# EAGLE design MineralFire-0.3-smd-inprogress (EAGLE 9.1.3)

## Sheet 1 of 3: Main function
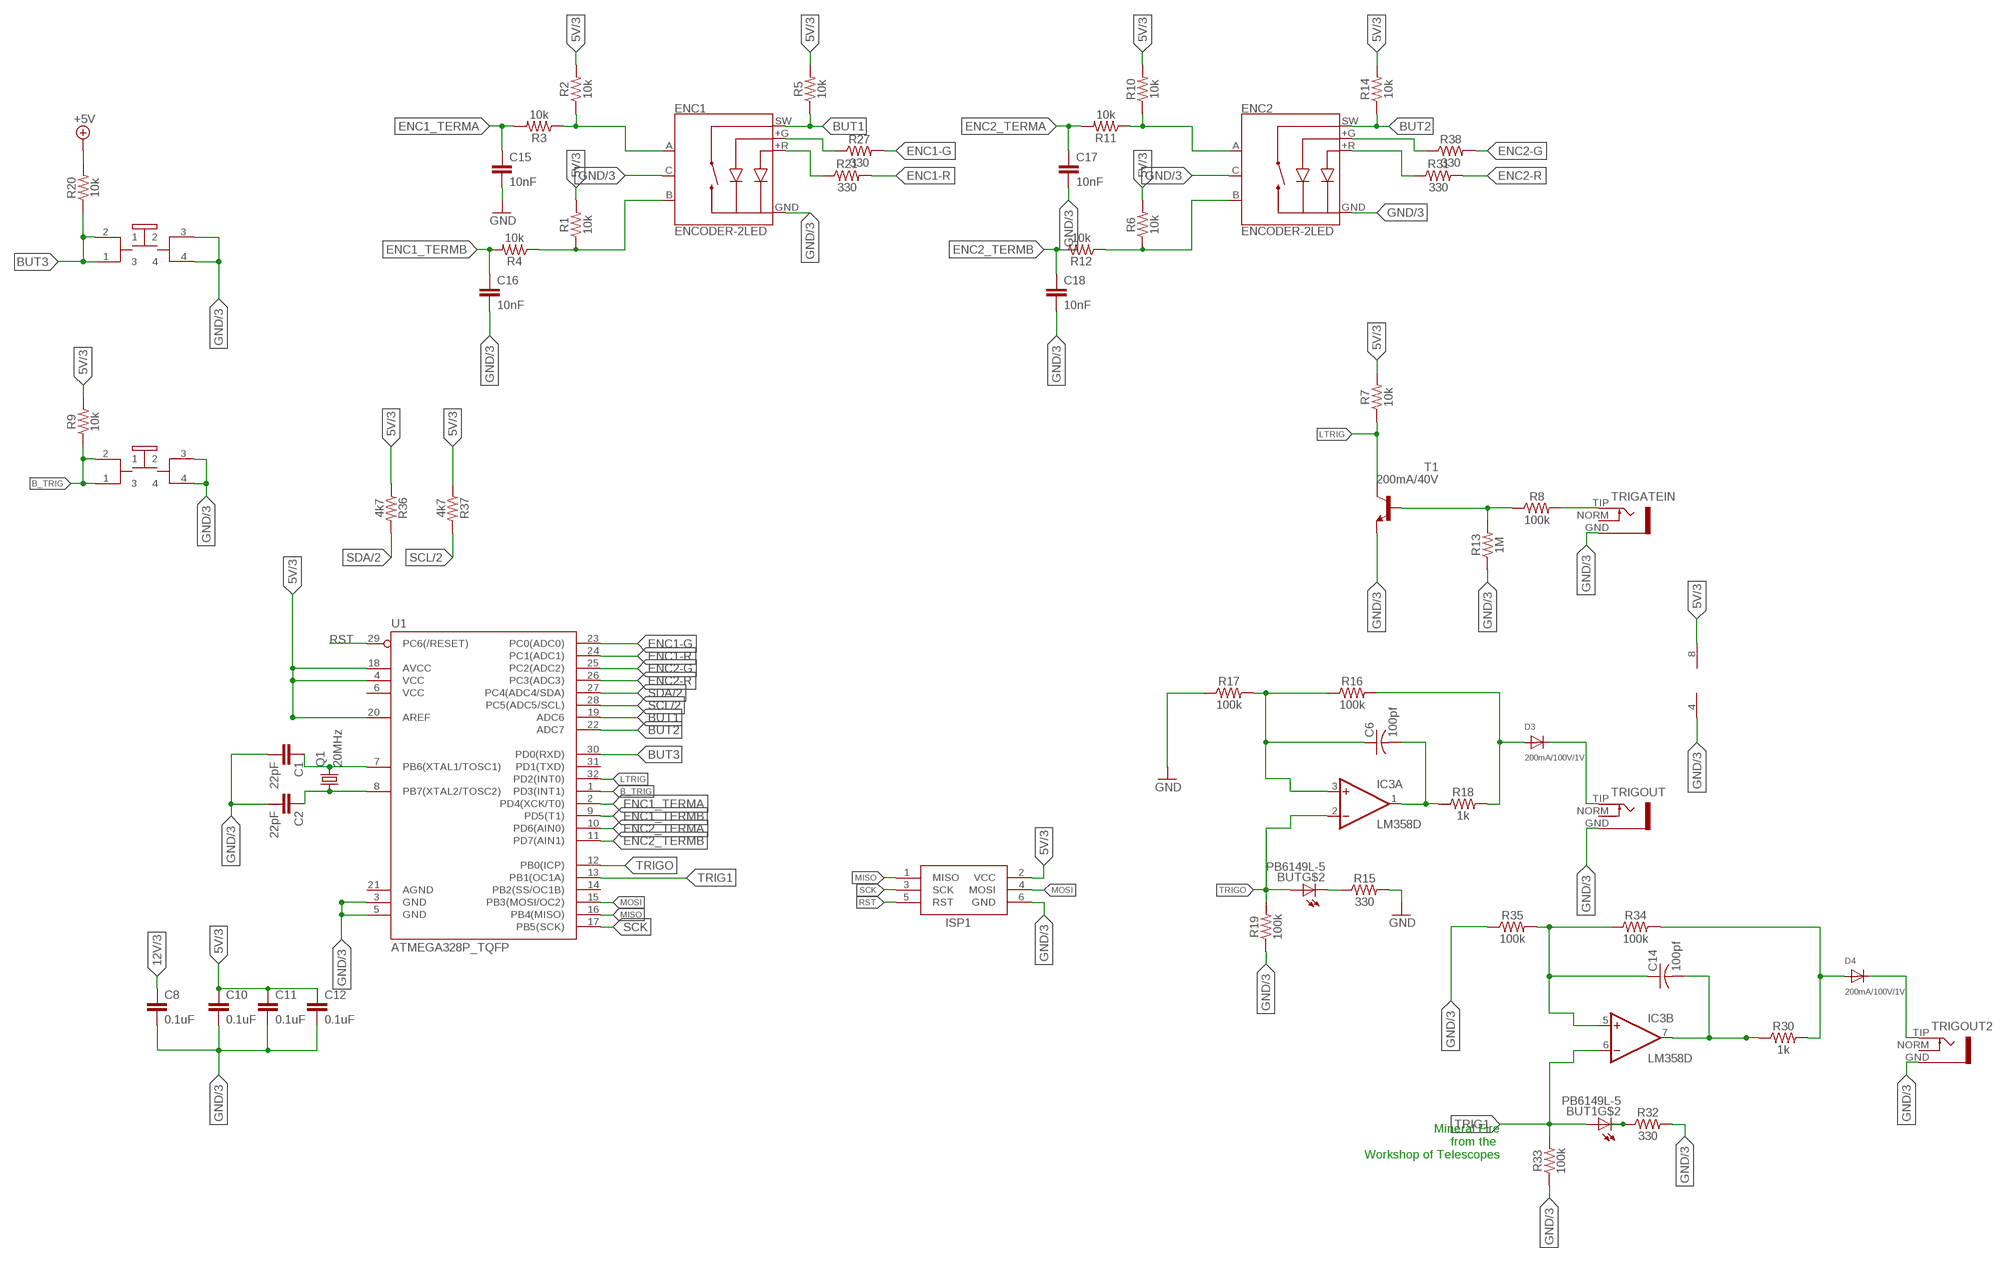
[diagram p0: schematic, sheet 1]

### Parts
BUT  PB6149L-5  [PB6149L]
BUT1  PB6149L-5  [PB6149L]
C1  22pF  22PF-0603-50V-5%  [0603]
C2  22pF  22PF-0603-50V-5%  [0603]
C6  100pf  C-USC0805K  [C0805K]
C8  0.1uF  0.1UF-0603-100V-10%  [0603]
C10  0.1uF  0.1UF-0603-100V-10%  [0603]
C11  0.1uF  0.1UF-0603-100V-10%  [0603]
C12  0.1uF  0.1UF-0603-100V-10%  [0603]
C14  100pf  C-USC0805K  [C0805K]
C15  10nF  10NF-0603-50V-10%  [0603]
C16  10nF  10NF-0603-50V-10%  [0603]
C17  10nF  10NF-0603-50V-10%  [0603]
C18  10nF  10NF-0603-50V-10%  [0603]
D3  200mA/100V/1V  DIODESMA  [SMADIODE]
D4  200mA/100V/1V  DIODESMA  [SMADIODE]
ENC1  ENCODER-2LED  [ENCODER_LED_2]
ENC2  ENCODER-2LED  [ENCODER_LED_2]
IC3  LM358D  [SO08]
ISP1  AVRISP-6  [AVRISP]
Q1  20MHz  CRYSTALHC49UP  [HC49UP]
R1  10k  10KOHM-0603-1/10W-1%  [0603]
R2  10k  10KOHM-0603-1/10W-1%  [0603]
R3  10k  10KOHM-0603-1/10W-1%  [0603]
R4  10k  10KOHM-0603-1/10W-1%  [0603]
R5  10k  10KOHM-0603-1/10W-1%  [0603]
R6  10k  10KOHM-0603-1/10W-1%  [0603]
R7  10k  10KOHM-0603-1/10W-1%  [0603]
R8  100k  100KOHM-0603-1/10W-1%  [0603]
R9  10k  10KOHM-0603-1/10W-1%  [0603]
R10  10k  10KOHM-0603-1/10W-1%  [0603]
R11  10k  10KOHM-0603-1/10W-1%  [0603]
R12  10k  10KOHM-0603-1/10W-1%  [0603]
R13  1M  1MOHM-0603-1/4W-5%  [0603]
R14  10k  10KOHM-0603-1/10W-1%  [0603]
R15  330  330OHM-0603-1/10W-1%  [0603]
R16  100k  100KOHM-0603-1/10W-1%  [0603]
R17  100k  100KOHM-0603-1/10W-1%  [0603]
R18  1k  1KOHM-0603-1/10W-1%  [0603]
R19  100k  100KOHM-0603-1/10W-1%  [0603]
R20  10k  10KOHM-0603-1/10W-1%  [0603]
R21  330  330OHM-0603-1/10W-1%  [0603]
R27  330  330OHM-0603-1/10W-1%  [0603]
R30  1k  1KOHM-0603-1/10W-1%  [0603]
R31  330  330OHM-0603-1/10W-1%  [0603]
R32  330  330OHM-0603-1/10W-1%  [0603]
R33  100k  100KOHM-0603-1/10W-1%  [0603]
R34  100k  100KOHM-0603-1/10W-1%  [0603]
R35  100k  100KOHM-0603-1/10W-1%  [0603]
R36  4k7  1KOHM-0603-1/10W-1%  [0603]
R37  4k7  1KOHM-0603-1/10W-1%  [0603]
R38  330  330OHM-0603-1/10W-1%  [0603]
T1  200mA/40V  MMBT3904LT1-NPN-SOT23-BEC  [SOT23-BEC]
TRIGATEIN  S_JACK  [S_JACK]
TRIGOUT  S_JACK  [S_JACK]
TRIGOUT2  S_JACK  [S_JACK]
U1  ATMEGA328P_TQFP  [TQFP32-08]

### Nets
5V: C10.1 C11.1 C12.1 IC3.8(P:V+) ISP1.2(VCC) R1.2 R2.2 R5.2 R6.2 R7.2 R9.2 R10.2 R14.2 R36.1 R37.1 U1.4(VCC) U1.18(AVCC) U1.20(AREF) ; also sheet 3
12V [12V]: C8.1 ; also sheet 3
+5V [Power]: R20.2 ; also sheet 2
B_TRIG: BUT.1 BUT.2 R9.1 U1.1(PD3(INT1))
BUT1 [Power]: ENC1.SW R5.1 U1.19(ADC6)
BUT2 [Power]: ENC2.SW R14.1 U1.22(ADC7)
BUT3: BUT1.1 BUT1.2 R20.1 U1.30(PD0(RXD))
ENC1-G: R27.2 U1.23(PC0(ADC0))
ENC1-R: R21.2 U1.24(PC1(ADC1))
ENC1_TERMA: C15.1 R3.2 U1.2(PD4(XCK/T0))
ENC1_TERMB: C16.1 R4.2 U1.9(PD5(T1))
ENC2-G: R38.2 U1.25(PC2(ADC2))
ENC2-R: R31.2 U1.26(PC3(ADC3))
ENC2_TERMA: C17.1 R11.2 U1.10(PD6(AIN0))
ENC2_TERMB: C18.1 R12.2 U1.11(PD7(AIN1))
GND [Power]: BUT1.3 BUT1.4 BUT.3 BUT.4 C1.2 C2.2 C8.2 C10.2 C11.2 C12.2 C15.2 C16.2 C17.2 C18.2 ENC1.C ENC1.GND(-) ENC2.C ENC2.GND(-) IC3.4(P:V-) ISP1.6(GND) R13.1 R15.2 R17.1 R19.1 R32.2 R33.1 R35.1 T1.E TRIGATEIN.GND TRIGOUT2.GND TRIGOUT.GND U1.3(GND) U1.5(GND) ; also sheet 2,3
LTRIG: R7.1 T1.C U1.32(PD2(INT0))
MISO: ISP1.1(MISO) U1.16(PB4(MISO))
MOSI: ISP1.4(MOSI) U1.15(PB3(MOSI/OC2))
N$1: C1.1 Q1.2 U1.7(PB6(XTAL1/TOSC1))
N$2: C2.1 Q1.1 U1.8(PB7(XTAL2/TOSC2))
N$3: ENC1.+R R21.1
N$6: ENC1.A R2.1 R3.1
N$12: ENC1.B R1.1 R4.1
N$15: R8.1 R13.2 T1.B
N$18: R8.2 TRIGATEIN.TIP
N$19: C14.2 IC3.7(B:OUT) R30.1
N$21: BUT1.K(C) R32.1
N$22: D4.A R30.2 R34.2
N$23: D4.C TRIGOUT2.TIP
N$24: C14.1 IC3.5(B:+IN) R34.1 R35.2
N$27: ENC2.A R10.1 R11.1
N$28: ENC2.B R6.1 R12.1
N$30: ENC1.+G R27.1
N$31: BUT.K(C) R15.1
N$32: C6.1 IC3.3(A:+IN) R16.1 R17.2
N$33: C6.2 IC3.1(A:OUT) R18.1
N$34: D3.A R16.2 R18.2
N$35: ENC2.+G R38.1
N$36: ENC2.+R R31.1
N$74: D3.C TRIGOUT.TIP
RST: ISP1.5(RST) U1.29(PC6(/RESET))
SCK: ISP1.3(SCK) U1.17(PB5(SCK))
SCL: R37.2 U1.28(PC5(ADC5/SCL)) ; also sheet 2
SDA: R36.2 U1.27(PC4(ADC4/SDA)) ; also sheet 2
TRIG1: BUT1.A IC3.6(B:-IN) R33.2 U1.13(PB1(OC1A))
TRIGO: BUT.A IC3.2(A:-IN) R19.2 U1.12(PB0(ICP))
Unconnected: TRIGATEIN.NORM TRIGOUT2.NORM TRIGOUT.NORM U1.6(VCC) U1.14(PB2(SS/OC1B)) U1.21(AGND) U1.31(PD1(TXD))

### Notes on the sheet
- Mineral Fire
  from the 
  Workshop of Telescopes

## Sheet 2 of 3: Display
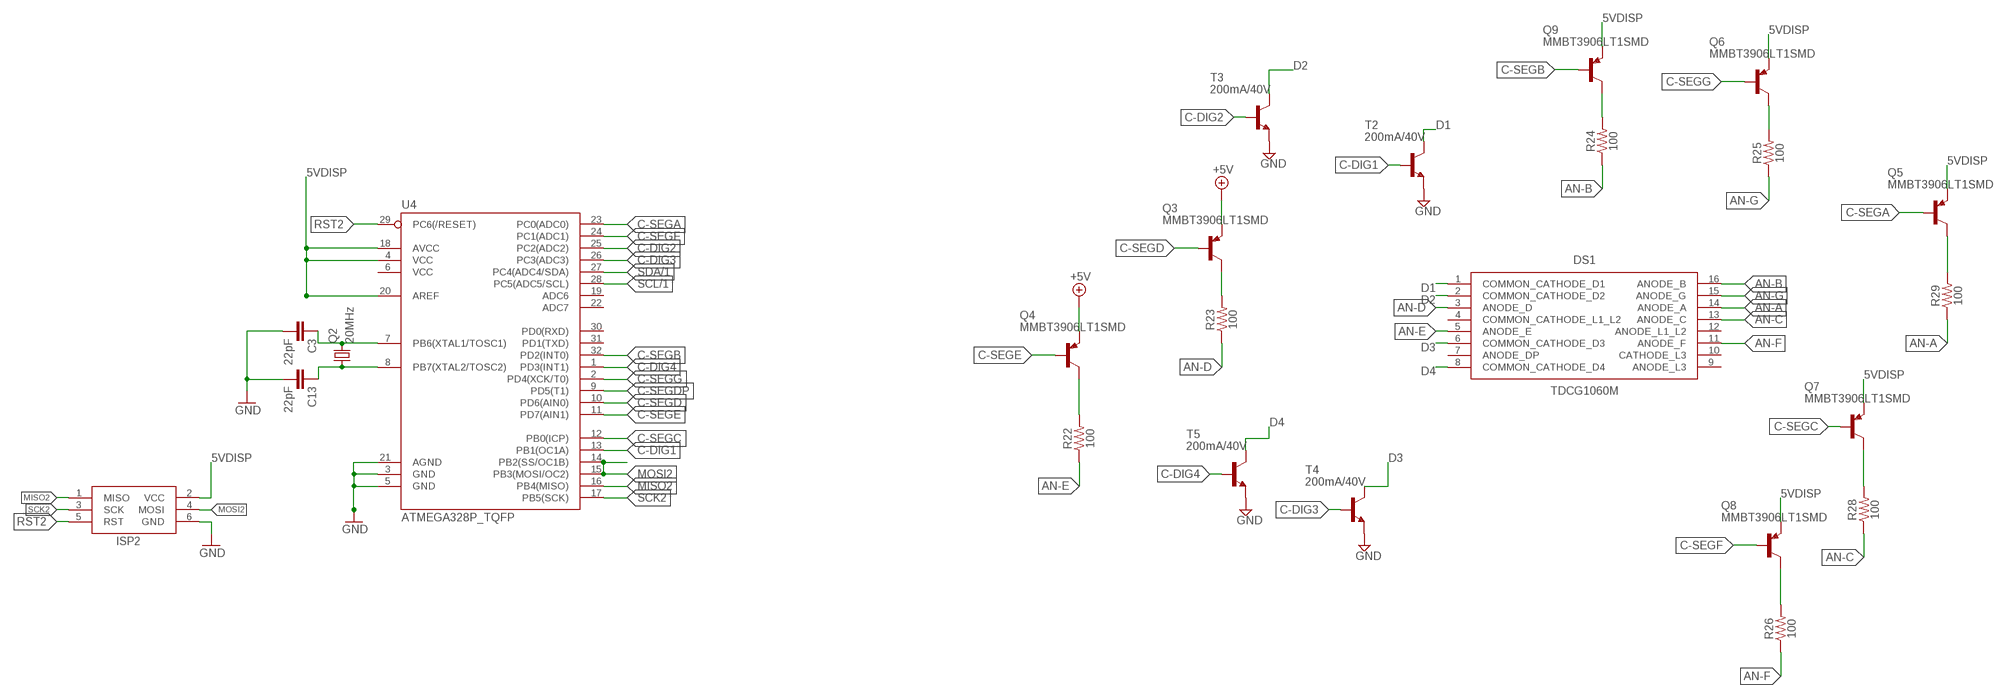
[diagram p1: schematic, sheet 2]

### Parts
C3  22pF  22PF-0603-50V-5%  [0603]
C13  22pF  22PF-0603-50V-5%  [0603]
DS1  TDCG1060M  [DIPS1016W50P254L4020H700Q16N]
ISP2  AVRISP-6  [AVRISP]
Q2  20MHz  CRYSTALHC49UP  [HC49UP]
Q3  MMBT3906LT1SMD  [SOT23-BEC]
Q4  MMBT3906LT1SMD  [SOT23-BEC]
Q5  MMBT3906LT1SMD  [SOT23-BEC]
Q6  MMBT3906LT1SMD  [SOT23-BEC]
Q7  MMBT3906LT1SMD  [SOT23-BEC]
Q8  MMBT3906LT1SMD  [SOT23-BEC]
Q9  MMBT3906LT1SMD  [SOT23-BEC]
R22  100  100OHM-0603-1/10W-1%  [0603]
R23  100  100OHM-0603-1/10W-1%  [0603]
R24  100  100OHM-0603-1/10W-1%  [0603]
R25  100  100OHM-0603-1/10W-1%  [0603]
R26  100  100OHM-0603-1/10W-1%  [0603]
R28  100  100OHM-0603-1/10W-1%  [0603]
R29  100  100OHM-0603-1/10W-1%  [0603]
T2  200mA/40V  MMBT3904LT1-NPN-SOT23-BEC  [SOT23-BEC]
T3  200mA/40V  MMBT3904LT1-NPN-SOT23-BEC  [SOT23-BEC]
T4  200mA/40V  MMBT3904LT1-NPN-SOT23-BEC  [SOT23-BEC]
T5  200mA/40V  MMBT3904LT1-NPN-SOT23-BEC  [SOT23-BEC]
U4  ATMEGA328P_TQFP  [TQFP32-08]

### Nets
5VDISP [Power]: ISP2.2(VCC) Q5.E Q6.E Q7.E Q8.E Q9.E U4.4(VCC) U4.18(AVCC) U4.20(AREF) ; also sheet 3
+5V [Power]: Q3.E Q4.E ; also sheet 1
AN-A: DS1.14(ANODE_A) R29.1
AN-B: DS1.16(ANODE_B) R24.1
AN-C: DS1.13(ANODE_C) R28.1
AN-D: DS1.3(ANODE_D) R23.1
AN-E: DS1.5(ANODE_E) R22.1
AN-F: DS1.11(ANODE_F) R26.1
AN-G: DS1.15(ANODE_G) R25.1
C-DIG1: T2.B U4.13(PB1(OC1A))
C-DIG2: T3.B U4.25(PC2(ADC2))
C-DIG3: T4.B U4.26(PC3(ADC3))
C-DIG4: T5.B U4.1(PD3(INT1))
C-SEGA: Q5.B U4.23(PC0(ADC0))
C-SEGB: Q9.B U4.32(PD2(INT0))
C-SEGC: Q7.B U4.12(PB0(ICP))
C-SEGD: Q3.B U4.10(PD6(AIN0))
C-SEGDP: U4.9(PD5(T1))
C-SEGE: Q4.B U4.11(PD7(AIN1))
C-SEGF: Q8.B U4.24(PC1(ADC1))
C-SEGG: Q6.B U4.2(PD4(XCK/T0))
D1: DS1.1(COMMON_CATHODE_D1) T2.C
D2: DS1.2(COMMON_CATHODE_D2) T3.C
D3: DS1.6(COMMON_CATHODE_D3) T4.C
D4: DS1.8(COMMON_CATHODE_D4) T5.C
GND [Power]: C3.2 C13.2 ISP2.6(GND) T2.E T3.E T4.E T5.E U4.3(GND) U4.5(GND) U4.21(AGND) ; also sheet 1,3
MISO2: ISP2.1(MISO) U4.16(PB4(MISO))
MOSI2: ISP2.4(MOSI) U4.14(PB2(SS/OC1B)) U4.15(PB3(MOSI/OC2))
N$5: Q4.C R22.2
N$7: C3.1 Q2.2 U4.7(PB6(XTAL1/TOSC1))
N$8: C13.1 Q2.1 U4.8(PB7(XTAL2/TOSC2))
N$11: Q3.C R23.2
N$13: Q9.C R24.2
N$14: Q8.C R26.2
N$16: Q7.C R28.2
N$17: Q6.C R25.2
N$20: Q5.C R29.2
RST2: ISP2.5(RST) U4.29(PC6(/RESET))
SCK2: ISP2.3(SCK) U4.17(PB5(SCK))
SCL: U4.28(PC5(ADC5/SCL)) ; also sheet 1
SDA: U4.27(PC4(ADC4/SDA)) ; also sheet 1
Unconnected: DS1.4(COMMON_CATHODE_L1_L2) DS1.7(ANODE_DP) DS1.9(ANODE_L3) DS1.10(CATHODE_L3) DS1.12(ANODE_L1_L2) U4.6(VCC) U4.19(ADC6) U4.22(ADC7) U4.30(PD0(RXD)) U4.31(PD1(TXD))

## Sheet 3 of 3: Power
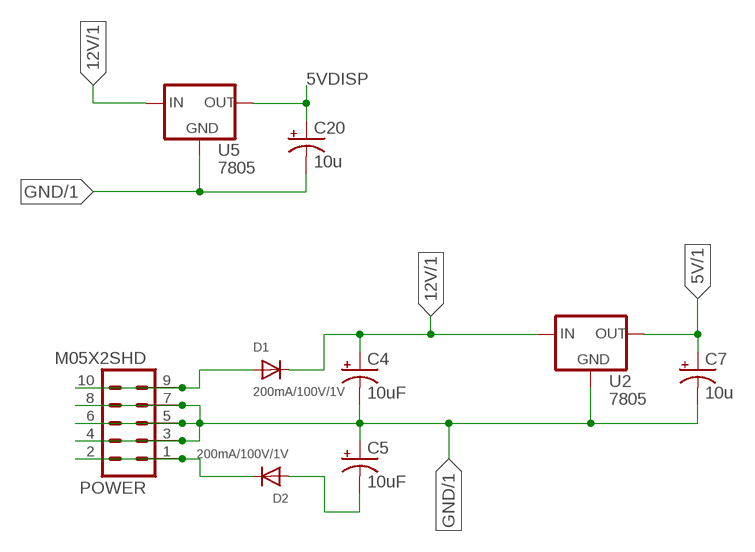
[diagram p2: schematic, sheet 3]

### Parts
C4  10uF  CPOL-US153CLV-0505  [153CLV-0505]
C5  10uF  CPOL-US153CLV-0505  [153CLV-0505]
C7  10u  CPOL-US153CLV-0505  [153CLV-0505]
C20  10u  CPOL-US153CLV-0505  [153CLV-0505]
D1  200mA/100V/1V  DIODESMA  [SMADIODE]
D2  200mA/100V/1V  DIODESMA  [SMADIODE]
POWER  M05X2SHD  [2X5-SHROUDED]
U2  7805  V-REG  [V-REG]
U5  7805  V-REG  [V-REG]

### Nets
5V: C7.+ U2.3(OUT) ; also sheet 1
5VDISP [Power]: C20.+ U5.3(OUT) ; also sheet 2
12V [12V]: C4.+ D1.C U2.1(IN) U5.1(IN) ; also sheet 1
GND [Power]: C4.- C5.+ C7.- C20.- POWER.3 POWER.4 POWER.5 POWER.6 POWER.7 POWER.8 U2.4(GND) U5.4(GND) ; also sheet 1,2
N$9: D1.A POWER.9 POWER.10
N$10: D2.C POWER.1 POWER.2
N$38 [Power]: C5.- D2.A

## Library data of the parts
BUT BUT1 = INSTRUO:PB6149L-5
C1-C3 C13 = SparkFun-Capacitors:22PF: 22pF ceramic capacitors A capacitor is a passive two-terminal electrical component used to store electrical energy temporarily in an electric field.; PROD_ID: CAP-07876
C4 C5 = rcl:CPOL-US: POLARIZED CAPACITOR, American symbol; SPICEPREFIX: C
C6 C14 = rcl:C-US: CAPACITOR, American symbol; SPICEPREFIX: C
C7 C20 = rcl:CPOL-US: POLARIZED CAPACITOR, American symbol
C8 C10-C12 = SparkFun-Capacitors:0.1UF: 0.1µF ceramic capacitors A capacitor is a passive two-terminal electrical component used to store electrical energy temporarily in an electric field.; PROD_ID: CAP-08390
C15-C18 = SparkFun-Capacitors:10NF: 0.01uF/10nF/10,000pF ceramic capacitors A capacitor is a passive two-terminal electrical component used to store electrical energy temporarily in an electric field. CAP-09321; PROD_ID: CAP-00867
D1-D4 = adafruit:DIODE: Diode SMADIODE - SMA Surface Mount Package 20V 1A Schottky Diode Digikey: 641-1014-6-ND DO-1N4148 - Through Hole Small Current Diode SOD-123 20V 1 A (.5mV Vf) Schottky Diode - Digikey: MBRX120TPMSCT-ND SOD-323 10V 570mA (.38mV Vf, 3ns) Schottky Diode - Digikey: ZLLS410CT-ND SOD-523 30V 30mA Schottky Diode (RB751S-40TE61) - Digikey: RB751S-40TE61CT-ND SOT23-R/W - SOT23 Package (R = Solder Paste/Reflow Ovens, W = Hand-Soldering) BAT54Film 40V 300mA - Digikey: 497-7162-1-ND
DS1 = TDCG1060M:TDCG1060M: VISHAY - TDCG1060M - DISPLAY, SEVEN SEGMENT, 10MM, GREEN <https://componentsearchengine.com/Images/1/TDCG1060M.jpg> Source: Datasheet <http://www.mouser.com/ds/2/427/tdc10m-88849.pdf>; DESCRIPTION: VISHAY - TDCG1060M - DISPLAY, SEVEN SEGMENT, 10MM, GREEN; HEIGHT: 7mm; MANUFACTURER_NAME: Vishay; MANUFACTURER_PART_NUMBER: TDCG1060M; RS_PART_NUMBER: 8187530P; SUPPLIER_NAME: RS
ENC1 ENC2 = SparkFun-Switches:ENCODER-2LED: Illuminated Rotary Encoder w/ 2 LEDs Rotary encoders rotate similarly to potentiometers, but they’re different from potentiometers in that an encoder has full rotation without limits. They output gray code so that you can tell how much and in which direction the encoder has been turned. This encoder has a red/green LED built-in, which shines through the encoder shaft. SparkFun Products Rotary Encoder - Illuminated (Red/Green) <https://www.sparkfun.com/products/10596> (COM-10596) SparkFun Rotary Encoder Breakout - Illuminated (RG/RGB) <https://www.sparkfun.com/products/11722> (BOB-11722); PROD_ID: COMP-11113; SF_SKU: COM-10596
IC3 = linear:LM358: OP AMP also LM158; LM258; LM2904 Source: http://cache.national.com/ds/LM/LM158.pdf
ISP1 ISP2 = adafruit:AVRISP: AVR ISP HEADER Standard 6 pin header for AVR programming
POWER = SparkFun-Connectors:M05X2: Header 5x2 Standard 10-pin dual row 0.1" header. Commonly used with AVR-ISP. Use with Spark Fun Electronics SKU: PRT-00778
Q1 Q2 = adafruit:CRYSTAL: CRYSTAL; OC_FARNELL: unknown; OC_NEWARK: unknown
Q3-Q9 = transistor-pnp:MMBT3906*: PNP Transistror
R1-R7 R9-R12 R14 R20 = SparkFun-Resistors:10KOHM: 10kΩ resistor A resistor is a passive two-terminal electrical component that implements electrical resistance as a circuit element. Resistors act to reduce current flow, and, at the same time, act to lower voltage levels within circuits. - Wikipedia; PROD_ID: RES-00824
R8 R16 R17 R19 R33-R35 = SparkFun-Resistors:100KOHM: 100kΩ resistor A resistor is a passive two-terminal electrical component that implements electrical resistance as a circuit element. Resistors act to reduce current flow, and, at the same time, act to lower voltage levels within circuits. - Wikipedia; PROD_ID: RES-07828
R13 = SparkFun-Resistors:1MOHM: 1MΩ resistor A resistor is a passive two-terminal electrical component that implements electrical resistance as a circuit element. Resistors act to reduce current flow, and, at the same time, act to lower voltage levels within circuits. - Wikipedia; PROD_ID: RES-07868
R15 R21 R27 R31 R32 R38 = SparkFun-Resistors:330OHM: 330Ω resistor A resistor is a passive two-terminal electrical component that implements electrical resistance as a circuit element. Resistors act to reduce current flow, and, at the same time, act to lower voltage levels within circuits. - Wikipedia; PROD_ID: RES-00818
R18 R30 = SparkFun-Resistors:1KOHM: 1kΩ resistor A resistor is a passive two-terminal electrical component that implements electrical resistance as a circuit element. Resistors act to reduce current flow, and, at the same time, act to lower voltage levels within circuits. - Wikipedia; PROD_ID: RES-07856
R22-R26 R28 R29 = SparkFun-Resistors:100OHM: 100Ω resistor A resistor is a passive two-terminal electrical component that implements electrical resistance as a circuit element. Resistors act to reduce current flow, and, at the same time, act to lower voltage levels within circuits. - Wikipedia; PROD_ID: RES-07863
R36 R37 = SparkFun-Resistors:1KOHM: 1kΩ resistor A resistor is a passive two-terminal electrical component that implements electrical resistance as a circuit element. Resistors act to reduce current flow, and, at the same time, act to lower voltage levels within circuits. - Wikipedia; PROD_ID: RES-07856; VALUE: 1k
T1-T5 = transistor:*-NPN-: NPN Transistror BF959 corrected 2008.03.06
TRIGATEIN TRIGOUT TRIGOUT2 = INSTRUO:S_JACK
U1 U4 = SparkFun-IC-Microcontroller:ATMEGA328P_TQFP: Popular 328P in QFP Storefront component: ATmega328 - TQFP <https://www.sparkfun.com/products/13448> (COM-13448) Datasheet <http://www.sparkfun.com/datasheets/Components/SMD/ATMega328.pdf> SparkFun Products SparkFun RedBoard - Programmed with Arduino <https://www.sparkfun.com/products/12757> (DEV-12757) Arduino Pro Mini 328 - 5V/16MHz <https://www.sparkfun.com/products/11113> (DEV-11113) Arduino Pro Mini 328 - 3.3V/8MHz <https://www.sparkfun.com/products/11114> (DEV-11114) SparkFun OpenLog <https://www.sparkfun.com/products/13712> (DEV-13712) SparkFun MicroView - OLED Arduino Module <https://www.sparkfun.com/products/12923> (DEV-12923) SparkFun Digital Sandbox <https://www.sparkfun.com/products/12651> (DEV-12651) SparkFun PicoBoard <https://www.sparkfun.com/products/11888> (WIG-11888) Arduino Fio <https://www.sparkfun.com/products/10116> (DEV-10116) LilyPad Arduino 328 Main Board <https://www.sparkfun.com/products/13342> (DEV-13342) SparkFun RedStick <https://www.sparkfun.com/products/13741> (DEV-13741) LilyPad MP3 <https://www.sparkfun.com/products/11013> (DEV-11013) LilyPad Arduino SimpleSnap <https://www.sparkfun.com/products/10941> (DEV-10941) SparkFun Stepoko <https://www.sparkfun.com/products/13899> (ROB-13899) SparkFun Geiger Counter <https://www.sparkfun.com/products/11345> (SEN-11345) SparkFun EL Sequencer <https://www.sparkfun.com/products/12781> (COM-12781) Arduino Pro 328 - 5V/16MHz <https://www.sparkfun.com/products/10915> (DEV-10915) CryptoCape <https://www.sparkfun.com/products/12773> (DEV-12773) SparkFun IR Thermometer Evaluation Board - MLX90614 <https://www.sparkfun.com/products/10740> (SEN-10740) SparkFun RedBot Mainboard <https://www.sparkfun.com/products/12097> (ROB-12097) Arduino Pro 328 - 3.3V/8MHz <https://www.sparkfun.com/products/10914> (DEV-10914) SparkFun Block for Intel® Edison - Arduino <https://www.sparkfun.com/products/13036> (DEV-13036) SparkFun Simon Says - Surface Mount Soldering Kit <https://www.sparkfun.com/products/10935> (KIT-10935) SparkFun 7-Segment Serial Display - Red <https://www.sparkfun.com/products/11441> (COM-11441) SparkFun 7-Segment Serial Display - White <https://www.sparkfun.com/products/11629> (COM-11629) SparkFun 7-Segment Serial Display - Yellow <https://www.sparkfun.com/products/11443> (COM-11443) SparkFun 7-Segment Serial Display - Kelly Green <https://www.sparkfun.com/products/11440> (COM-11440) SparkFun 7-Segment Serial Display - Blue <https://www.sparkfun.com/products/11442> (COM-11442) SparkFun OpenSegment Serial Display - 20mm (Blue) <https://www.sparkfun.com/products/11647> (COM-11647) SparkFun OpenSegment Serial Display - 20mm (Green) <https://www.sparkfun.com/products/11646> (COM-11646) SparkFun OpenSegment Serial Display - 20mm (White) <https://www.sparkfun.com/products/11648> (COM-11648) SparkFun OpenSegment Serial Display - 20mm (Red) <https://www.sparkfun.com/products/11644> (COM-11644) SparkFun OpenSegment Serial Display - 20mm (Yellow) <https://www.sparkfun.com/products/11645> (COM-11645) SparkFun OpenSegment Shield <https://www.sparkfun.com/products/13190> (DEV-13190); PROD_ID: IC-09069
U2 U5 = INSTRUO:V-REG

## Net classes
1 Power: width 0.35 mm
2 12V: width 0.6 mm

## Board
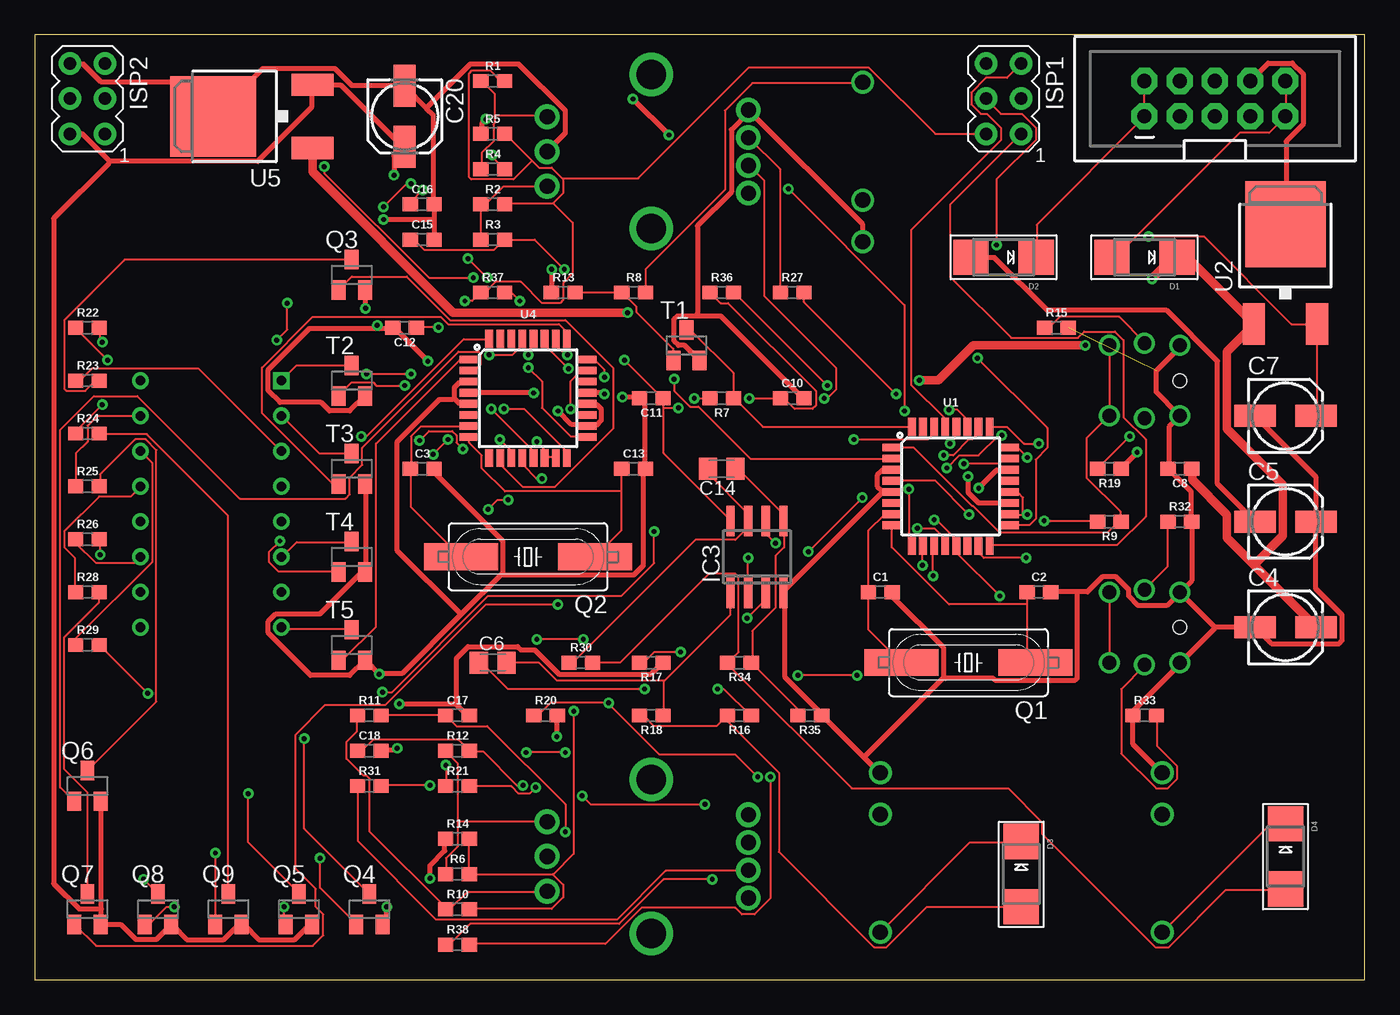
[diagram p3: board, top side]
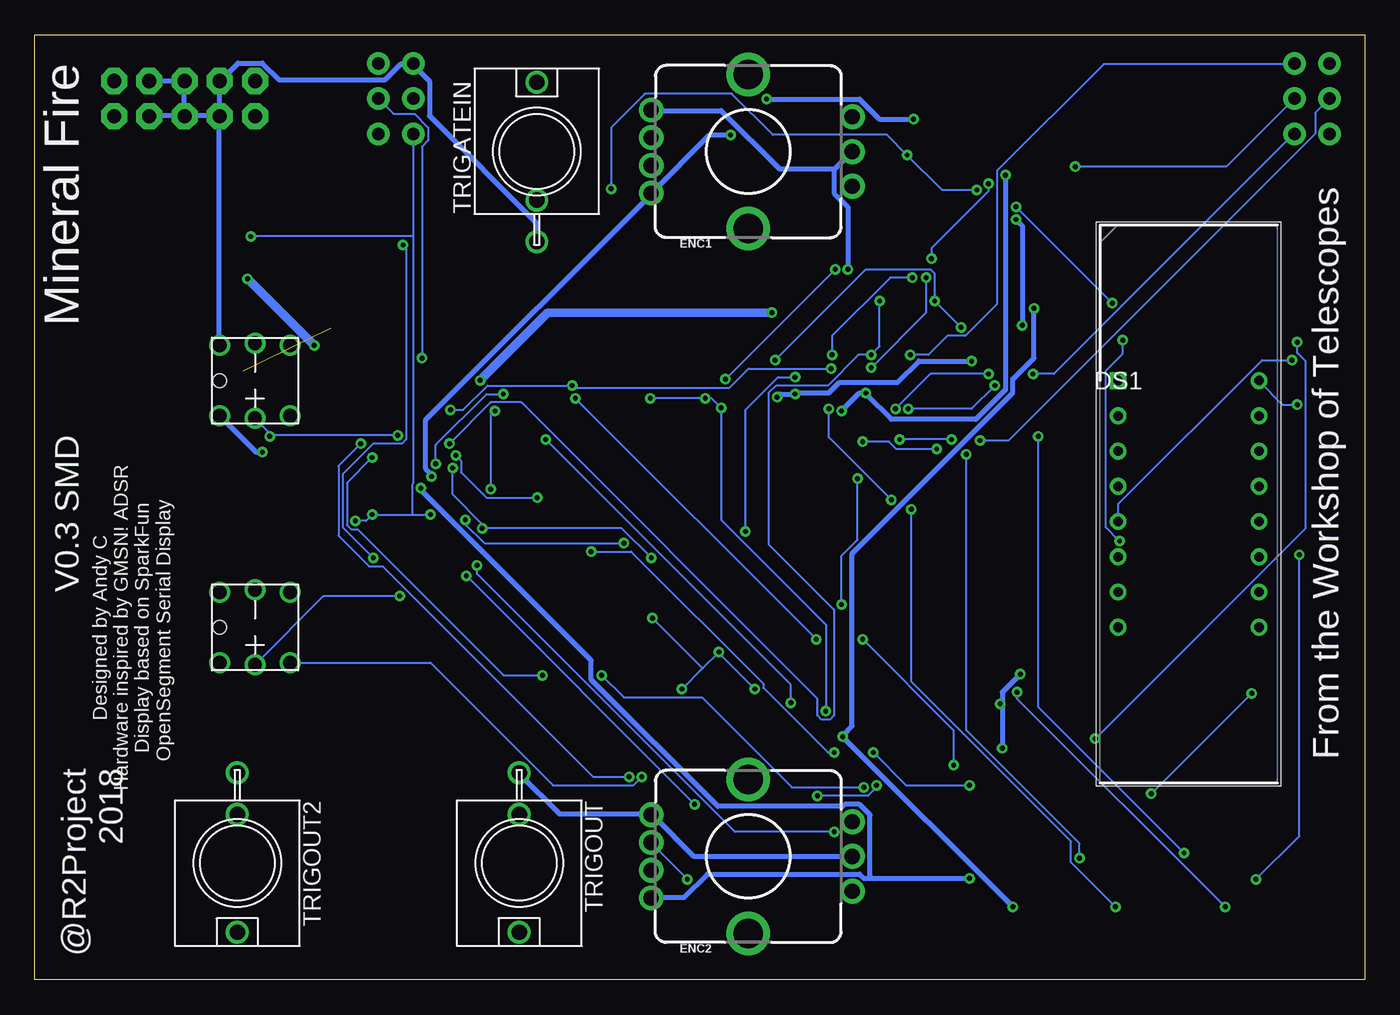
[diagram p4: board, bottom side, seen from below]

Size 95.89 x 68.11 mm. Coordinates in mm from the lower left corner, seen from the top.
Outline: 0,0 95.89,0 95.89,68.11 0,68.11 0,0
Copper layers (1*16): Top 0.035mm / dielectric 1.5mm / Bottom 0.035mm
Design rules "default": minimum track width 6mil, minimum drill 0.35mm, track to track 6mil, track to pad 6mil, pad to pad 6mil, via to via 6mil, smd to smd 6mil, copper to edge 40mil, drill to drill 6mil, minimum pad ring 10mil, minimum via ring 8mil, stop-mask expansion 4mil, vias tented up to drill 0mil, thermal gap 10mil

### Footprints (pad centres in the part's own frame; a part is rotated, then mirrored left to right if it is on the bottom)
PB6149L = drill 1: 1 2.54,-2.54; 2 2.54,2.54; 3 -2.54,-2.54; 4 -2.54,2.54; A 0,-2.7; K 0,2.7 | hole 1: -2.54,0
0603 = smd 1.1 x 1: 1 -0.85,0; 2 0.85,0
153CLV-0505 = smd 3 x 1.6: + 2.2,0; - -2.2,0
C0805K = smd 1.3 x 1.6: 1 -1,0; 2 1,0
SMADIODE = smd 2.54 x 2.54: A 2.349,0; C -2.349,0
DIPS1016W50P254L4020H700Q16N = drill 0.7 pad 1.1 square: 1 0,0 | drill 0.7 pad 1.1: 2 0,-2.54; 3 0,-5.08; 4 0,-7.62; 5 0,-10.16; 6 0,-12.7; 7 0,-15.24; 8 0,-17.78; 9 10.16,-17.78; 10 10.16,-15.24; 11 10.16,-12.7; 12 10.16,-10.16; 13 10.16,-7.62; 14 10.16,-5.08; 15 10.16,-2.54; 16 10.16,0
ENCODER_LED_2 = drill 1.1 pad 1.778: +G 1,7; +R -1,7; GND 3,7; SW -3,7 | drill 1.1 pad 1.8: A -2.5,-7.5; B 2.5,-7.5; C 0,-7.5 | drill 2.1: P$1 -5.55,0; P$2 5.55,0
SO08 = smd 0.6 x 2.2: 1 -1.905,-2.6; 2 -0.635,-2.6; 3 0.635,-2.6; 4 1.905,-2.6; 5 1.905,2.6; 6 0.635,2.6; 7 -0.635,2.6; 8 -1.905,2.6
AVRISP = drill 0.9 pad 1.626: 1 -1.27,2.54; 2 1.27,2.54; 3 -1.27,0; 4 1.27,0; 5 -1.27,-2.54; 6 1.27,-2.54
2X5-SHROUDED = drill 1.016 pad 1.88 octagon: 1 -1.27,5.08; 2 1.27,5.08; 3 -1.27,2.54; 4 1.27,2.54; 5 -1.27,0; 6 1.27,0; 7 -1.27,-2.54; 8 1.27,-2.54; 9 -1.27,-5.08; 10 1.27,-5.08
HC49UP = smd 5.334 x 1.93: 1 -4.826,0; 2 4.826,0
SOT23-BEC = smd 1 x 1.4: B -0.95,-1.1; C 0,1.1; E 0.95,-1.1
S_JACK = drill 1.1: GND 0,-6.5; NORM 0,-3.5; TIP 0,5
TQFP32-08 = smd 1.27 x 0.559: 1 -4.293,2.8; 2 -4.293,2; 3 -4.293,1.2; 4 -4.293,0.4; 5 -4.293,-0.4; 6 -4.293,-1.2; 7 -4.293,-2; 8 -4.293,-2.8; 17 4.293,-2.8; 18 4.293,-2; 19 4.293,-1.2; 20 4.293,-0.4; 21 4.293,0.4; 22 4.293,1.2; 23 4.293,2; 24 4.293,2.8 | smd 0.559 x 1.27: 9 -2.8,-4.293; 10 -2,-4.293; 11 -1.2,-4.293; 12 -0.4,-4.293; 13 0.4,-4.293; 14 1.2,-4.293; 15 2,-4.293; 16 2.8,-4.293; 25 2.8,4.293; 26 2,4.293; 27 1.2,4.293; 28 0.4,4.293; 29 -0.4,4.293; 30 -1.2,4.293; 31 -2,4.293; 32 -2.8,4.293
V-REG = smd 1.6 x 3: 1 -2.28,-4.8; 3 2.28,-4.8 | smd 5.8 x 6.2: 4 0,2.38

### Placement (x,y rotation side)
BUT  80.01,43.18 0 bottom
BUT1  80.01,25.4 0 bottom
C1  60.96,27.94 0 top
C2  72.39,27.94 0 top
C3  27.94,36.83 0 top
C4  90.17,25.4 0 top
C5  90.17,33.02 0 top
C6  33.02,22.86 0 top
C7  90.17,40.64 0 top
C8  82.55,36.83 180 top
C10  54.61,41.91 0 top
C11  44.45,41.91 180 top
C12  26.67,46.99 180 top
C13  43.18,36.83 0 top
C14  49.53,36.83 180 top
C15  27.94,53.34 0 top
C16  27.94,55.88 0 top
C17  30.48,19.05 0 top
C18  24.13,16.51 0 top
C20  26.67,62.23 270 top
D1  80.01,52.07 180 top
D2  69.85,52.07 180 top
D3  71.12,7.62 270 top
D4  90.17,8.89 270 top
DS1  17.78,43.18 0 bottom
ENC1  44.45,59.69 90 bottom
ENC2  44.45,8.89 90 bottom
IC3  52.07,30.48 0 top
ISP1  69.85,63.5 180 top
ISP2  3.81,63.5 180 top
POWER  85.09,63.5 90 top
Q1  67.31,22.86 180 top
Q2  35.56,30.48 180 top
Q3  22.86,50.8 0 top
Q4  24.13,5.08 0 top
Q5  19.05,5.08 0 top
Q6  3.81,13.97 0 top
Q7  3.81,5.08 0 top
Q8  8.89,5.08 0 top
Q9  13.97,5.08 0 top
R1  33.02,64.77 0 top
R2  33.02,55.88 0 top
R3  33.02,53.34 0 top
R4  33.02,58.42 0 top
R5  33.02,60.96 0 top
R6  30.48,7.62 0 top
R7  49.53,41.91 180 top
R8  43.18,49.53 0 top
R9  77.47,33.02 180 top
R10  30.48,5.08 0 top
R11  24.13,19.05 0 top
R12  30.48,16.51 0 top
R13  38.1,49.53 0 top
R14  30.48,10.16 0 top
R15  73.66,46.99 0 top
R16  50.8,19.05 180 top
R17  44.45,22.86 180 top
R18  44.45,19.05 180 top
R19  77.47,36.83 180 top
R20  36.83,19.05 0 top
R21  30.48,13.97 0 top
R22  3.81,46.99 0 top
R23  3.81,43.18 0 top
R24  3.81,39.37 0 top
R25  3.81,35.56 0 top
R26  3.81,31.75 0 top
R27  54.61,49.53 0 top
R28  3.81,27.94 0 top
R29  3.81,24.13 0 top
R30  39.37,22.86 0 top
R31  24.13,13.97 0 top
R32  82.55,33.02 0 top
R33  80.01,19.05 0 top
R34  50.8,22.86 180 top
R35  55.88,19.05 180 top
R36  49.53,49.53 0 top
R37  33.02,49.53 0 top
R38  30.48,2.54 0 top
T1  46.99,45.72 0 top
T2  22.86,43.18 0 top
T3  22.86,36.83 0 top
T4  22.86,30.48 0 top
T5  22.86,24.13 0 top
TRIGATEIN  59.69,59.69 0 bottom
TRIGOUT  60.96,8.42 180 bottom
TRIGOUT2  81.28,8.42 180 bottom
U1  66.04,35.56 0 top
U2  90.17,52.07 0 top
U4  35.56,41.91 0 top
U5  15.24,62.23 90 top

### Tracks (layer width: path | path; a pad name or v marks a point on that pad's centre or on a via)
5V  (via drill 0.35)
  Top 0.152: C7.+ 92.43,40.69 92.43,47.24 U2.3 92.35,47.24 90.6,47.24 84.28,53.57 v80.31,53.57 | v72.77,33.07 76.58,33.07 R9.2 | 71.25,33.53 70.33,33.53 U1.18 | 71.25,33.53 v71.55,33.53 71.25,33.53 | v67.36,33.53 64.92,35.97 61.8,35.97 U1.4 | 71.25,33.53 71.25,34.75 70.87,35.13 70.33,35.13 U1.20 | v29.11,47.02 27.58,47.02 C12.1 | v31.01,48.92 31.55,48.92 32.16,49.53 R37.1 32.23,49.53 32.46,49.53 33.22,50.29 35.05,50.29 36.58,48.77 37.87,48.77 38.1,49 38.1,50.22 38.79,50.9 38.79,54.56 37.41,55.93 37.38,55.97 | 37.38,55.97 38.1,56.69 38.1,57.68 38.06,57.72 | 37.38,55.97 37.34,55.93 33.91,55.93 R2.2 | 38.06,57.72 37.26,58.52 36.35,58.52 35.85,59.02 | 35.85,59.02 33.91,60.96 R5.2 | R1.2 33.83,64.77 33.6,64.77 32.84,65.53 31.55,65.53 31.32,65.3 31.32,57.84 31.47,57.68 34.52,57.68 35.81,58.98 35.85,59.02 | R36.1 48.69,49.53 49.45,48.77 49.99,48.77 56.31,42.44 56.31,41.38 56.08,41.15 54.79,41.15 54.03,41.91 53.8,41.91 C10.1 53.72,41.91 v51.51,41.91 | 37.38,7.58 37.34,7.62 31.39,7.62 R6.2 31.32,7.62 31.32,10.13 R14.2 | 37.38,7.58 38.1,6.86 38.1,5.94 37.26,5.11 31.39,5.11 R10.2 | 45.34,41.22 45.34,37.95 50.14,33.15 IC3.8 | 45.34,41.22 45.34,41.91 C11.1 45.26,41.91 v42.52,44.65 | v47.55,41.91 48.62,41.91 R7.2 | 45.34,41.22 v46.41,41.22 | v38.86,19.36 38.86,9.07 37.41,7.62 37.38,7.58 | ISP1.2 64.92,60.96 60.12,65.76 51.51,65.76 43.51,57.76 38.1,57.76 38.06,57.72
  Bottom 0.152: v72.77,33.07 72.01,33.07 v71.55,33.53 68.66,33.53 | 68.66,33.53 v67.36,33.53 | 68.58,53.57 68.58,35.81 68.66,35.74 68.66,33.53 | 68.58,53.57 ISP1.2 | 68.58,53.57 v80.31,53.57 | v29.11,47.02 v31.01,48.92 31.01,50.9 31.32,51.21 35.97,51.21 v42.52,44.65 | v38.86,19.36 38.86,25.6 46.41,33.15 v46.41,41.22 47.09,41.91 v47.55,41.91 v51.51,41.91
5VDISP  (via drill 0.35)
  Top 0.35: 4.8,5.11 4.8,4.12 Q7.E 4.8,3.96 6.25,3.96 7.32,2.9 8.76,2.9 9.83,3.96 Q8.E 9.98,3.89 10.97,2.9 13.64,2.9 14.71,3.96 14.86,3.96 Q9.E 15.09,3.96 16.15,2.9 18.75,2.9 19.81,3.96 19.96,3.96 Q5.E | 4.8,5.11 4.8,12.8 Q6.E | U4.20 39.85,41.45 40.54,41.45 40.84,41.15 40.84,40.31 40.46,39.93 39.85,39.93 U4.18 39.7,40.01 38.71,40.01 v37.72,41 | v35.97,42.29 31.32,42.29 U4.4 | 5.41,58.98 3.43,60.96 2.59,60.96 ISP2.2 | 5.41,58.98 16.08,58.98 19.96,62.87 19.96,64.31 U5.3 20.04,64.47 22.1,64.47 26.52,60.05 26.67,60.05 C20.+ 26.44,59.89 25.91,59.36 v25.91,57.99 | 4.8,5.11 4.65,5.11 3.2,5.11 1.37,6.93 1.37,54.86 5.33,58.83 5.41,58.98
  Bottom 0.35: v37.72,41 36.42,42.29 v35.97,42.29 35.89,42.14 34.14,40.39 28.04,40.39 25.91,42.52 v25.91,57.99
12V  (via drill 0.35)
  Top 0.6: 87.9,29.91 92.35,25.45 C4.+ | 87.9,29.91 85.95,31.85 85.95,33.53 83.44,36.04 83.44,36.8 C8.1 | v42.75,48.08 30.18,48.08 20.04,58.22 20.04,59.89 U5.1 | v63.78,43.2 65.15,43.2 67.67,45.72 v75.74,45.72 | v80.54,50.52 82.07,52.05 D1.C 82.37,52.05 83.13,52.05 87.86,47.32 U2.1 87.71,47.02 85.95,45.26 85.95,39.7 89.99,35.66 89.99,32 88.09,30.1 87.9,29.91
  Bottom 0.6: v42.75,48.08 58.9,48.08 v63.78,43.2 | v80.54,50.52 v75.74,45.72
+5V  (via drill 0.35)
  Top 0.35: v37.64,17.53 37.64,19.05 R20.2 | v25.38,5.26 25.38,4.27 25.15,4.04 Q4.E | v23.85,48.39 23.85,49.68 Q3.E
  Bottom 0.35: v25.38,5.26 v37.64,17.53 37.57,17.68 36.96,18.29 36.96,30.71 25.38,42.29 25.38,43.28 23.85,44.81 v23.85,48.39
AN-A
  Top 0.152: DS1.14 8.46,37.26 8.46,30.1 2.97,24.61 2.97,24.16 R29.1
AN-B  (via drill 0.35)
  Top 0.152: v4.88,41.45 2.97,39.55 2.97,39.4 R24.1
  Bottom 0.152: v4.88,41.45 5.94,41.45 7.62,43.13 DS1.16
AN-C
  Top 0.152: R28.1 2.9,27.96 2.9,30.4 2.13,31.17 2.13,32.31 4.65,34.82 6.93,34.82 7.62,35.51 DS1.13
AN-D
  Top 0.152: R23.1 2.97,43.2 3.28,43.2 4.12,44.04 11.81,44.04 17.75,38.1 DS1.3
AN-E  (via drill 0.35)
  Top 0.152: v5.26,44.65 2.97,46.94 R22.1
  Bottom 0.152: v5.26,44.65 7.39,44.65 17.75,34.29 17.75,33.07 DS1.5
AN-F
  Top 0.152: DS1.11 7.16,30.02 4.42,30.02 2.97,31.47 2.97,31.7 R26.1
AN-G
  Top 0.152: R25.1 2.97,35.59 2.97,37.95 3.81,38.79 3.81,39.93 4.5,40.62 7.62,40.62 DS1.15
B_TRIG
  Top 0.152: U1.1 61.8,38.33 63.4,38.33 67.59,34.14 67.67,34.14 69.57,32.23 77.34,32.23 78.18,33.07 R9.1 78.26,33.07 78.26,33.76 75.82,36.2 75.82,39.01 77.42,40.62 BUT.1 77.5,40.69 77.5,45.72 BUT.2
BUT1  (via drill 0.35)
  Top 0.35: v32.54,62.03 32.23,61.72 32.23,60.96 R5.1 | v45.72,60.88 v43.13,63.48 | v67.28,36.27 67.28,35.13 68.05,34.37 U1.19
  Bottom 0.35: v32.54,62.03 34.98,62.03 36.42,63.48 v43.13,63.48 | v45.72,60.88 47.24,60.88 51.44,56.69 ENC1.SW 51.51,56.54 67.74,40.31 67.74,36.88 67.28,36.42 v67.28,36.27
BUT2  (via drill 0.35)
  Top 0.35: v28.5,7.32 28.5,8.23 29.57,9.3 29.57,10.13 R14.1 | v68.05,35.43 69.34,36.73 70.33,36.73 U1.22
  Bottom 0.35: 35.66,7.32 36.12,7.32 36.42,7.62 47.4,7.62 49.07,5.94 51.44,5.94 ENC2.SW | 35.66,7.32 v28.5,7.32 | v68.05,35.43 68.05,35.28 55.78,23.01 55.78,21.64 46.63,12.5 37.64,12.5 37.49,12.65 36.42,12.65 35.66,11.89 35.66,7.47 35.66,7.32
BUT3  (via drill 0.35)
  Top 0.152: 41.34,19.93 45.03,16.23 50.52,16.23 v52.12,14.63 | 41.34,19.93 41.3,19.96 37.19,19.96 36.27,19.05 36.04,19.05 R20.1 | v59.05,38.94 64.39,38.94 64.77,39.32 64.77,39.85 U1.30 | v41.38,19.96 41.34,19.93 | BUT1.2 77.5,27.89 77.5,22.86 BUT1.1
  Bottom 0.152: v52.12,14.63 52.73,14.02 58.52,14.02 67.36,22.86 77.42,22.86 BUT1.1 | v59.05,38.94 41.38,21.26 v41.38,19.96
C-DIG1  (via drill 0.35)
  Top 0.152: v32.92,41.15 35.89,38.18 35.89,37.64 U4.13 | v26.67,42.82 24.61,42.82 24.38,43.05 22.86,43.05 21.95,42.14 T2.B
  Bottom 0.152: v32.92,41.15 28.35,41.15 v26.67,42.82
C-DIG2
  Top 0.152: U4.25 38.33,46.25 38.33,46.71 37.8,47.24 29.79,47.24 29.26,47.78 20.04,47.78 16.38,44.12 16.38,40.84 21.49,35.74 21.87,35.74 T3.B
C-DIG3  (via drill 0.35)
  Top 0.152: v38.41,45.03 38.25,45.03 37.57,45.72 37.57,46.18 U4.26 | v31.24,51.97 v32.61,50.6 | v27.13,57.38 26.82,57.38 v25.15,55.7 | v18.21,48.77 18.21,46.86 v17.45,46.1 | v17.68,31.62 16.92,30.86 16.92,30.1 17.6,29.41 21.87,29.41 T4.B
  Bottom 0.152: v38.41,45.03 38.41,46.41 34.21,50.6 v32.61,50.6 | v31.24,51.97 31.24,52.73 27.13,56.84 v27.13,57.38 | v18.21,48.77 v25.15,55.7 | v17.45,46.1 17.45,45.11 18.67,43.89 18.67,32.61 v17.68,31.62
C-DIG4
  Top 0.152: U4.1 31.24,44.65 30.63,44.65 24.61,38.63 24.61,25.45 22.25,23.09 21.95,23.09 T5.B
C-SEGA  (via drill 0.35)
  Top 0.152: v38.63,41.15 38.63,43.13 39.4,43.89 39.85,43.89 U4.23 | v34.14,34.59 33.38,34.59 v32.69,33.91 | v17.98,5.26 17.98,4.12 18.06,4.04 Q5.B
  Bottom 0.152: v38.63,41.15 38.63,39.09 v34.14,34.59 | v32.69,33.91 32.69,21.49 21.18,9.98 21.18,8.46 v17.98,5.26
C-SEGB  (via drill 0.35)
  Top 0.152: v23.55,39.17 23.93,39.17 30.94,46.18 32.69,46.18 U4.32 | v13.03,9.14 13.03,4.04 Q9.B
  Bottom 0.152: v23.55,39.17 23.55,19.66 v13.03,9.14
C-SEGC  (via drill 0.35)
  Top 0.152: v36.58,36.12 36.2,36.12 35.2,37.11 35.2,37.57 U4.12 | v37.72,27.05 32.54,27.05 25.3,19.81 20.95,19.81 18.82,17.68 18.82,8 20.27,6.55 20.27,5.26 20.8,4.72 20.8,3.2 20.04,2.44 4.42,2.44 2.9,3.96 Q7.B
  Bottom 0.152: v36.58,36.12 36.58,31.7 37.72,30.56 v37.72,27.05
C-SEGD
  Top 0.152: U4.10 33.6,37.57 33.6,37.11 35.2,35.51 37.49,35.51 41.68,39.7 41.68,44.12 38.25,47.55 29.95,47.55 26.82,50.67 22.86,50.67 21.95,49.76 Q3.B
C-SEGE  (via drill 0.35)
  Top 0.152: v33.53,38.94 34.29,38.18 34.29,37.64 U4.11 | v28.73,37.87 v29.79,38.94 | v20.57,8.76 20.57,6.63 23.16,4.04 Q4.B
  Bottom 0.152: v29.79,38.94 v33.53,38.94 | v28.73,37.87 28.73,17.98 20.57,9.83 v20.57,8.76
C-SEGF  (via drill 0.35)
  Top 0.152: v41.07,43.43 41.07,43.97 40.39,44.65 39.85,44.65 U4.24 | v44.65,32.31 44.65,30.02 42.29,27.66 32.69,27.66 25.76,20.73 v25.07,20.73 | v10.06,5.26 9.53,5.26 8.31,4.04 8,4.04 Q8.B
  Bottom 0.152: v41.07,43.43 42.29,43.43 44.65,41.07 v44.65,32.31 | v25.07,20.73 25.07,20.27 v10.06,5.26
C-SEGG
  Top 0.152: U4.2 31.32,43.97 31.77,43.97 32.16,44.35 32.16,45.11 32,45.26 30.56,45.26 23.62,38.33 23.62,37.11 22.71,36.2 22.71,34.98 22.4,34.67 14.78,34.67 7.39,42.06 4.27,42.06 1.83,39.62 1.83,13.87 2.82,12.88 Q6.B
D1
  Top 0.152: T2.C 18.9,44.27 17.83,43.2 DS1.1
D2
  Top 0.152: T3.C 22.86,37.95 20.5,37.95 17.83,40.62 DS1.2
D3
  Top 0.152: T4.C 22.86,31.55 18.9,31.55 17.83,30.48 DS1.6
D4
  Top 0.152: T5.C 22.86,25.3 17.91,25.3 17.83,25.38 DS1.8
ENC1-G  (via drill 0.35)
  Top 0.152: v62.1,42.22 55.47,48.84 55.47,49.53 R27.2 | v66.98,37.19 69.49,37.19 69.8,37.49 70.33,37.49 U1.23
  Bottom 0.152: v62.1,42.22 63.32,42.22 66.98,38.56 v66.98,37.19
ENC1-R  (via drill 0.35)
  Top 0.152: v36.12,13.87 35.66,13.41 34.9,13.41 34.37,13.95 31.39,13.95 R21.2 | v59.28,21.95 v55.02,21.95 | v71.55,37.64 70.87,38.33 70.33,38.33 U1.24
  Bottom 0.152: v36.12,13.87 41.3,13.87 47.78,20.34 53.42,20.34 v55.02,21.95 | v59.28,21.95 62.1,21.95 72.62,32.46 73.08,32.46 73.38,32.77 73.38,35.81 v71.55,37.64
ENC1_TERMA  (via drill 0.35)
  Top 0.152: C15.1 27.13,53.34 27.36,53.34 28.12,52.58 33.07,52.58 33.83,53.34 R3.2 33.91,53.34 36.04,53.34 v38.18,51.21 | v46.1,43.28 46.1,42.44 47.24,41.3 47.85,41.3 51.59,37.57 61.72,37.57 U1.2
  Bottom 0.152: v38.18,51.21 v46.1,43.28
ENC1_TERMB  (via drill 0.35)
  Top 0.152: v27.96,56.92 27.13,56.08 27.13,55.93 C16.1 | v32.99,59.44 32.99,59.28 33.83,58.45 R4.2 | v63.02,35.36 63.02,32.23 63.17,32.08 63.17,31.32 U1.9 | v62.71,41 62.71,48.62 v54.33,57
  Bottom 0.152: v27.96,56.92 30.48,56.92 v32.99,59.44 34.44,60.88 42.67,60.88 45.64,63.86 51.89,63.86 54.33,61.42 v54.33,57 | v63.02,35.36 63.02,40.69 v62.71,41
ENC2-G  (via drill 0.35)
  Top 0.152: v53.03,14.63 53.03,5.87 51.89,4.72 50.98,4.72 50.52,5.18 43.74,5.18 41.15,2.59 31.39,2.59 R38.2 | v72.39,38.63 71.32,38.63 70.1,39.85 68.89,39.85 U1.25
  Bottom 0.152: v53.03,14.63 55.63,14.63 70.79,29.79 71.78,29.79 73.99,32 73.99,37.03 v72.39,38.63
ENC2-R  (via drill 0.35)
  Top 0.152: v28.5,14.02 24.99,14.02 R31.2 | v38.25,16.38 v35.43,16.38 | v59.66,34.75 v55.78,30.86 | v65.53,37.8 66.22,37.8 67.36,38.94 67.59,38.94 67.97,39.32 67.97,39.85 U1.26
  Bottom 0.152: v28.5,14.02 33.07,14.02 v35.43,16.38 | v38.25,16.38 38.71,16.38 43.36,21.03 43.36,21.34 52.88,30.86 v55.78,30.86 | v59.66,34.75 63.32,34.75 65.15,36.58 65.15,37.41 v65.53,37.8
ENC2_TERMA  (via drill 0.35)
  Top 0.152: R11.2 24.99,19.05 29.57,19.05 C17.1 29.64,19.05 30.4,18.29 32.61,18.29 38.25,12.65 v38.25,10.67 | v64.01,29.87 64.01,31.24 U1.10
  Bottom 0.152: v64.01,29.87 64.01,29.26 45.41,10.67 v38.25,10.67
ENC2_TERMB  (via drill 0.35)
  Top 0.152: C18.1 23.32,16.54 23.62,16.54 24.38,17.3 30.56,17.3 31.32,16.54 R12.2 31.39,16.46 32.31,16.46 34.75,14.02 v35.2,14.02 | v64.77,29.11 64.77,31.24 U1.11 | v48.31,12.65 40.08,12.65 v39.47,13.26
  Bottom 0.152: v48.31,12.65 v64.77,29.11 | v39.47,13.26 35.81,13.26 35.2,13.87 v35.2,14.02
GND  (via drill 0.35)  (1 unrouted)
  Top 0.35: 24.69,46.94 19.81,46.94 16.84,43.97 16.84,42.44 17.68,41.6 20.65,41.6 21.26,41 22.71,41 23.77,42.06 T2.E | 24.69,46.94 25.76,46.94 C12.2 25.98,46.94 v28.35,44.58 | v41.07,42.22 41,42.29 39.85,42.29 U4.21 | v42.37,41.99 43.43,41.99 C11.2 43.66,41.91 43.97,41.6 43.97,36.88 C13.2 43.89,36.73 43.89,29.87 43.2,29.18 33.83,29.18 33.76,29.34 | T3.E 23.85,35.66 23.85,29.41 T4.E 23.7,29.26 23.47,29.26 20.57,26.36 17.37,26.36 16.84,25.83 16.84,24.99 19.89,21.95 22.71,21.95 23.7,22.94 T5.E 23.85,23.01 v24.84,22.02 24.99,22.1 26.52,22.1 30.75,26.33 | 30.25,41.91 30.63,41.53 31.24,41.53 U4.5 | 30.25,41.91 30.25,42.67 30.63,43.05 31.24,43.05 U4.3 | v26.14,16.69 25.98,16.54 24.99,16.54 C18.2 | 30.33,19.89 31.17,19.05 31.32,19.05 C17.2 | v26.29,19.89 30.33,19.89 | R17.1 45.26,22.86 44.42,22.02 37.8,22.02 36.04,23.77 35.05,23.77 34.82,24 31.24,24 30.4,23.16 30.4,20.04 30.33,19.89 | 33.76,29.34 33.76,31.62 28.8,36.58 28.8,36.8 C3.2 | 30.75,26.33 33.76,29.34 | 30.25,41.91 30.1,41.83 29.18,41.83 26.14,38.79 26.14,30.94 30.63,26.44 30.75,26.33 | 28.8,54.79 28.8,55.85 C16.2 28.73,56.01 28.73,62.33 28.23,62.83 | 28.8,54.79 28.8,53.34 C15.2 | 28.23,62.83 26.67,64.39 C20.- 26.52,64.47 22.86,64.47 21.64,65.68 16.46,65.68 13.03,62.26 U5.4 12.8,62.26 10.36,64.69 4.8,64.69 3.5,65.99 2.59,65.99 ISP2.6 | v37.26,51.21 37.26,49.53 R13.1 | 47.78,47.85 46.33,47.85 46.1,47.62 46.1,46.02 46.41,45.72 46.86,45.72 47.93,44.65 T1.E | 47.78,47.85 49.45,47.85 55.4,41.91 C10.2 | TRIGATEIN.GND 59.66,53.26 59.66,54.48 51.51,62.64 ENC1.GND 51.44,62.48 50.22,61.27 50.22,56.77 47.78,54.33 47.78,48.01 47.78,47.85
  Top 0.35: 28.23,62.83 28.35,62.94 31.39,65.99 34.9,65.99 38.25,62.64 38.25,61.04 36.96,59.74 ENC1.C | v24.69,47.17 24.69,47.09 24.69,46.94 | v25.15,54.79 28.65,54.79 28.8,54.79 | 61.11,35.2 61.72,35.2 U1.5 | 61.11,35.2 60.73,35.59 60.73,36.35 61.11,36.73 61.72,36.73 U1.3 | 61.11,35.2 61.04,35.05 54.03,28.04 54.03,27.89 IC3.4 54.1,27.74 54.1,21.79 56.69,19.2 R35.1 56.77,19.05 59.78,16.04 | 59.78,16.04 60.96,14.86 TRIGOUT.GND | 65.53,21.79 65.53,23.93 61.87,27.58 61.87,27.89 C1.2 | 65.53,21.79 59.89,16.15 59.78,16.04 | POWER.8 88.92,66.06 90.68,66.06 91.44,65.3 91.44,61.65 90.22,60.43 90.22,54.48 U2.4 | v79.48,38.02 78.33,36.88 R19.1 | BUT.4 82.53,45.72 82.53,45.57 80.85,43.89 80.85,42.37 82.45,40.77 BUT.3 82.53,40.62 81.76,39.85 81.76,36.88 C8.2 81.84,36.73 83.36,35.2 83.36,33.07 R32.2 83.44,32.84 83.44,28.8 82.68,28.04 BUT1.4 | C7.- 88.01,40.62 92.35,36.27 92.35,33.07 C5.+ 92.35,32.84 92.35,28.19 94.26,26.29 94.26,24.46 94.03,24.23 89.15,24.23 88.09,25.3 C4.- 87.94,25.45 85.04,25.45 | TRIGOUT2.GND 81.23,14.94 79.17,16.99 79.17,19.05 R33.1 79.25,19.2 79.25,19.43 82.53,22.71 BUT1.3 82.6,22.86 85.04,25.3 85.04,25.45 | 75.13,27.96 75.89,27.96 76.96,29.03 77.95,29.03 78.87,28.12 78.87,27.66 79.55,26.98 81.61,26.98 82.53,27.89 BUT1.4 | 75.13,27.96 73.3,27.96 C2.2 | 85.04,25.45 82.68,27.81 BUT1.4 | 65.53,21.79 65.68,21.72 69.11,21.72 69.27,21.57 74.98,21.57 75.13,21.72 75.13,27.81 75.13,27.96
  Bottom 0.35: v42.37,41.99 42.14,42.22 v41.07,42.22 40.92,42.29 38.63,42.29 37.87,43.05 33.68,43.05 32.16,44.58 v28.35,44.58 | 26.14,19.89 26.14,20.73 v24.84,22.02 | 26.14,19.89 v26.14,16.69 | v26.29,19.89 26.14,19.89 | v37.26,51.21 37.26,55.7 38.25,56.69 38.25,58.37 | 38.25,58.37 36.96,59.66 ENC1.C | 38.25,58.37 38.41,58.45 42.22,58.45 46.41,62.64 51.44,62.64 ENC1.GND | v24.69,47.17 24.69,54.33 v25.15,54.79 | TRIGOUT.GND 60.96,14.86 58.06,11.96 51.51,11.96 ENC2.GND 51.28,11.81 48.39,8.91 36.96,8.91 ENC2.C | POWER.3 82.6,62.26 82.6,64.62 POWER.4 82.53,64.77 81.23,66.06 79.48,66.06 78.26,64.85 70.64,64.85 69.49,65.99 68.58,65.99 ISP1.6 68.5,65.84 67.44,64.77 67.44,62.26 59.74,54.56 59.74,53.26 TRIGATEIN.GND | POWER.5 85.04,62.26 82.75,62.26 POWER.3 | POWER.5 85.11,62.41 85.11,64.77 POWER.6 85.27,64.77 POWER.8 | POWER.7 87.63,62.26 85.27,62.26 POWER.5 | v79.48,38.02 79.93,38.02 82.53,40.62 BUT.3 | POWER.3 82.6,62.1 82.6,45.72 BUT.4
LTRIG
  Top 0.152: T1.C 47.02,46.79 47.32,46.79 50.37,43.74 50.37,41.91 R7.1 50.44,41.91 52.5,39.85 63.17,39.85 U1.32
MISO
  Top 0.152: U1.16 68.89,31.32 78.03,31.32 80.09,33.38 80.09,38.94 78.49,40.54 78.49,46.1 77.88,46.71 75.67,46.71 75.21,46.25 70.41,46.25 65.99,50.67 65.99,55.85 71.09,60.96 ISP1.1
MISO2  (via drill 0.35)
  Top 0.152: v33.83,41.15 35.28,41.15 38.33,38.1 38.33,37.64 U4.16 | v23.93,43.66 v27.13,43.66
  Bottom 0.152: v33.83,41.15 31.32,43.66 v27.13,43.66 | v23.93,43.66 22.4,43.66 5.11,60.96 ISP2.1
MOSI  (via drill 0.35)
  Top 0.152: v71.48,30.4 68.43,30.4 68.05,30.79 68.05,31.24 U1.15 | v69.34,52.96 69.34,57.68 72.16,60.5 72.16,61.42 71.17,62.41 69.65,62.41 68.58,63.48 ISP1.4
  Bottom 0.152: v71.48,30.4 73.69,32.61 73.69,36.42 71.48,38.63 69.42,38.63 69.11,38.94 69.11,52.73 v69.34,52.96
MOSI2  (via drill 0.35)
  Top 0.152: U4.15 37.49,37.64 36.8,37.64 U4.14 36.8,37.72 36.8,38.18 v36.2,38.79 | v30.86,38.25 30.4,38.71 30.4,39.24 30.1,39.55 28.42,39.55 v27.74,38.86
  Bottom 0.152: v36.2,38.79 34.29,38.79 33.76,38.25 v30.86,38.25 | v27.74,38.86 25.68,38.86 3.58,60.96 3.58,62.48 2.59,63.48 ISP2.4
N$1
  Top 0.152: Q1.2 60.12,25.22 60.12,27.89 C1.1 60.12,27.96 60.12,32.38 61.27,33.53 61.72,33.53 U1.7
N$2
  Top 0.152: 71.55,27.05 71.55,23.39 72.08,22.86 Q1.1 | 71.55,27.05 71.55,27.89 C2.1 | 71.55,27.05 65.91,27.05 61.8,31.17 61.8,32.69 U1.8
N$3  (via drill 0.35)
  Top 0.152: v29.64,15.47 29.64,14.02 R21.1 | v39.55,24.54 v36.2,24.54 | v56.92,41.91 57.15,41.91 57.76,42.52 57.76,44.12 52.58,49.3 52.58,57.61 51.51,58.67 ENC1.+R
  Bottom 0.152: v29.64,15.47 29.64,17.98 v36.2,24.54 | v56.92,41.91 v39.55,24.54
N$5  (via drill 0.35)
  Top 0.152: v4.88,45.95 4.72,46.1 4.72,46.94 R22.2 | v19.43,17.37 19.43,10.9 24.08,6.25 Q4.C
  Bottom 0.152: v4.88,45.95 4.88,45.19 4.27,44.58 4.27,32.54 v19.43,17.37
N$6
  Top 0.152: R3.1 32.16,53.34 32.16,55.85 R2.1 32.23,55.93 32.54,55.93 33.76,57.15 36.88,57.15 ENC1.A
N$7
  Top 0.152: U4.7 31.24,39.85 27.81,39.85 27.13,39.17 27.13,36.88 C3.1 27.13,36.8 27.13,34.06 30.71,30.48 Q2.2
N$8
  Top 0.152: 42.29,35.2 42.29,32.38 Q2.1 | 42.29,35.2 42.29,36.8 C13.1 | 42.29,35.2 33.91,35.2 32.23,36.88 32.23,37.8 31.32,38.71 31.32,39.09 U4.8
N$9
  Top 0.152: D1.A 77.72,52.12 77.95,52.12 86.87,61.04 89,61.04 90.14,62.18 POWER.9 90.22,62.26 90.22,64.77 POWER.10
N$10
  Top 0.152: D2.C 72.24,52.12 72.24,54.41 80.01,62.18 POWER.1 80.01,62.26 POWER.2
N$11
  Top 0.152: R23.2 4.65,43.13 4.34,43.13 3.66,42.44 2.29,42.44 2.13,42.6 2.13,47.55 6.48,51.89 Q3.C
N$12
  Top 0.152: 33.15,62.26 33.15,63.86 32.23,64.77 R1.1 | 33.15,62.26 33.15,61.72 33.07,61.65 33.07,60.43 32.23,59.59 32.23,58.45 R4.1 | 33.15,62.26 36.88,62.26 ENC1.B
N$13
  Top 0.152: R24.2 4.72,39.32 8.08,39.32 13.95,33.45 13.95,6.25 Q9.C
N$14  (via drill 0.35)
  Top 0.152: v4.72,30.63 4.72,31.7 R26.2 | v7.85,7.24 8.84,6.25 Q8.C
  Bottom 0.152: v4.72,30.63 4.72,10.36 v7.85,7.24
N$15
  Top 0.152: R13.2 39.01,49.53 42.29,49.53 R8.1 42.37,49.53 43.36,48.54 43.36,48.16 46.02,45.49 46.02,44.65 T1.B
N$16
  Top 0.152: R28.2 4.65,27.89 4.65,27.2 2.13,24.69 2.13,15.16 3.81,13.49 3.81,6.25 Q7.C
N$17
  Top 0.152: R25.2 4.72,35.59 4.72,36.42 7.24,38.94 8,38.94 8.76,38.18 8.76,20.04 3.81,15.09 Q6.C
N$18
  Top 0.152: R8.2 44.04,49.53 44.04,51.21 49.76,56.92 49.76,62.64 51.74,64.62 59.66,64.62 TRIGATEIN.TIP
N$19
  Top 0.152: R30.1 38.56,22.86 38.79,22.86 47.62,31.7 50.52,31.7 51.44,32.61 IC3.7 51.44,33.15 51.44,33.6 48.54,36.5 48.54,36.8 C14.2
N$20  (via drill 0.35)
  Top 0.152: v8.15,20.65 4.72,24.08 R29.2 | v15.39,13.41 15.39,9.91 19.05,6.25 Q5.C
  Bottom 0.152: v15.39,13.41 v8.15,20.65
N$21
  Top 0.152: R32.1 81.69,32.99 81.69,29.79 80.01,28.12 BUT1.K
N$22
  Top 0.152: R30.2 40.23,22.86 42.22,22.86 48.62,29.26 50.52,29.26 50.75,29.03 50.75,23.62 49.99,22.86 R34.2 50.06,22.86 50.06,22.63 58.9,13.79 70.18,13.79 72.62,11.35 72.62,10.52 80.77,2.36 81.76,2.36 85.88,6.48 90.14,6.48 D4.A
N$23
  Top 0.152: D4.C 90.14,11.2 89.08,11.2 81.31,3.43 TRIGOUT2.TIP
N$24
  Top 0.152: R35.2 55.02,19.05 55.02,19.51 51.66,22.86 R34.1 51.74,22.86 51.74,25.15 53.42,26.82 53.42,30.56 54.03,31.17 54.03,33.07 IC3.5 53.95,33.15 53.95,33.6 50.75,36.8 50.6,36.8 C14.1
N$27
  Top 0.152: ENC2.A 36.88,6.33 31.17,6.33 29.95,5.11 29.64,5.11 R10.1 29.64,5.18 24.16,10.67 24.16,14.48 23.93,14.71 23.7,14.71 22.48,15.93 22.48,17.14 23.24,17.91 23.24,19.05 R11.1
N$28
  Top 0.152: 30.48,11.43 30.48,15.62 29.64,16.46 R12.1 | 30.48,11.43 30.48,9.6 29.64,8.76 29.64,7.62 R6.1 | 30.48,11.43 36.88,11.43 ENC2.B
N$30
  Top 0.152: R27.1 53.72,49.53 53.72,58.45 51.51,60.66 ENC1.+G
N$31
  Top 0.152: R15.1 72.85,47.02 73.15,47.02 73.91,47.78 78.18,47.78 80.01,45.95 BUT.K
N$32  (via drill 0.35)
  Top 0.152: v46.56,23.62 44.65,23.62 43.89,22.86 43.66,22.86 R17.2 | v49.23,20.95 49.68,20.95 51.59,19.05 R16.1 | v43.97,20.95 34.14,20.95 32.23,22.86 32.08,22.86 C6.1 | v51.36,26.06 52.65,27.36 52.65,27.81 IC3.3
  Bottom 0.152: v49.23,20.95 47.74,22.44 | 47.74,22.44 v46.56,23.62 46.56,23.55 v43.97,20.95 | v51.36,26.06 47.78,22.48 47.74,22.44
N$33
  Top 0.152: 45.38,21.53 50.14,26.29 50.14,27.81 IC3.1 | 45.38,21.53 45.34,21.49 45.34,19.05 R18.1 | C6.2 34.06,22.86 36.35,22.86 37.64,21.57 45.34,21.57 45.38,21.53
N$34
  Top 0.152: R18.2 43.66,19.05 43.89,19.05 44.65,18.29 49.15,18.29 49.91,19.05 R16.2 49.76,18.82 53.65,14.94 53.65,9.22 60.5,2.36 61.42,2.36 64.31,5.26 71.09,5.26 D3.A
N$35  (via drill 0.35)
  Top 0.152: v48.84,7.24 45.34,7.24 42.14,4.04 31.39,4.04 29.95,2.59 29.64,2.59 R38.1
  Bottom 0.152: v48.84,7.24 51.44,9.83 ENC2.+G
N$36
  Top 0.152: R31.1 23.32,13.95 23.32,9.98 28.96,4.34 41.99,4.34 45.49,7.85 51.44,7.85 ENC2.+R
N$38
  Top 0.35: D2.A 67.51,52.05 69.19,52.05 73,48.23 81.61,48.23 85.27,44.58 85.27,35.74 87.94,33.07 C5.-
N$74
  Top 0.152: D3.C 71.09,9.91 67.44,9.91 TRIGOUT.TIP
RST
  Top 0.152: U1.29 65.61,39.85 65.61,40.46 63.17,42.9 63.17,54.03 69.65,60.5 69.65,61.42 68.66,62.41 68.2,62.41 67.51,63.09 67.51,63.93 68.58,65 70.1,65 71.09,65.99 ISP1.5
RST2  (via drill 0.35)
  Top 0.152: v32.77,45.03 34.44,45.03 35.13,45.72 35.13,46.18 U4.29
  Bottom 0.152: v32.77,45.03 31.47,45.03 30.1,46.41 28.8,46.41 26.52,48.69 26.52,58.29 18.82,65.99 5.11,65.99 ISP2.5
SCK  (via drill 0.35)
  Top 0.152: v67.97,44.81 73,39.78 73,38.33 72.16,37.49 72.16,33.22 71.7,32.77 U1.17
  Bottom 0.152: v67.97,44.81 67.97,60.05 67.51,60.5 67.51,61.42 68.5,62.41 70.03,62.41 71.09,63.48 ISP1.3
SCK2  (via drill 0.35)
  Top 0.152: v35.59,44.12 36.58,43.13 36.58,41.22 38.63,39.17 39.85,39.17 U4.17 | v31.62,50.6 28.42,50.6 20.88,58.14 v20.88,58.6
  Bottom 0.152: v35.59,44.12 31.62,48.08 v31.62,50.6 | v20.88,58.6 9.98,58.6 5.11,63.48 ISP2.3
SCL  (via drill 0.35)
  Top 0.152: v34.98,48.92 34.37,49.53 33.91,49.53 R37.2 | v35.59,45.03 35.59,45.34 35.89,45.64 35.89,46.18 U4.28 | v65.99,38.63 66.37,39.01 66.37,39.85 U1.28
  Bottom 0.152: v34.98,48.92 34.98,45.64 v35.59,45.03 36.5,45.03 38.71,42.82 42.44,42.82 42.98,42.29 42.98,31.39 38.25,26.67 38.25,19.05 38.56,18.75 39.17,18.75 39.47,19.05 39.47,20.27 60.81,41.6 63.02,41.6 v65.99,38.63
SDA  (via drill 0.35)
  Top 0.152: v57.15,42.82 50.44,49.53 R36.2 | v65.91,41.07 66.52,41.07 67.21,40.39 67.21,39.85 U1.27 | v38.48,44.04 36.8,45.72 36.8,46.18 U4.27
  Bottom 0.152: v65.91,41.07 65,41.07 63.25,42.82 v57.15,42.82 57,42.67 45.8,42.67 44.42,44.04 v38.48,44.04
TRIG1  (via drill 0.35)
  Top 0.152: R33.2 80.92,19.05 80.92,16.84 82.37,15.39 82.37,14.48 81.69,13.79 80.85,13.79 78.33,16.31 78.33,20.95 80.01,22.63 BUT1.A | v69.57,27.66 66.45,30.79 66.45,31.24 U1.13 66.37,31.32 66.37,31.77 65,33.15 v64.85,33.15 | v53.42,31.47 52.73,32.16 52.73,33.07 IC3.6
  Bottom 0.152: v69.57,27.66 75.06,27.66 BUT1.A | v53.42,31.47 63.48,31.47 64.85,32.84 v64.85,33.15
TRIGO  (via drill 0.35)
  Top 0.152: v78.94,39.17 76.66,36.88 R19.2 | v63.63,32.54 64.85,32.54 65.61,31.77 65.61,31.32 U1.12 | v51.44,30.4 IC3.2 | v69.72,39.24 69.49,39.24 68.05,37.8 66.67,37.8 v65.76,36.88
  Bottom 0.152: 78.94,39.24 78.94,39.4 80.01,40.46 BUT.A | 78.94,39.24 v78.94,39.17 78.94,39.24 | v51.44,30.4 53.57,32.54 v63.63,32.54 63.63,32.84 65.76,34.98 v65.76,36.88 | v69.72,39.24 78.94,39.24

### Text on the board
bNames: Mineral Fire | From the Workshop of Telescopes | V0.3 SMD | Designed by Andy C / Hardware inspired by GMSN! ADSR / Display based on SparkFun / OpenSegment Serial Display | @R2Project / 2018